# EAGLE design Adapter_board (EAGLE 7.7.0)
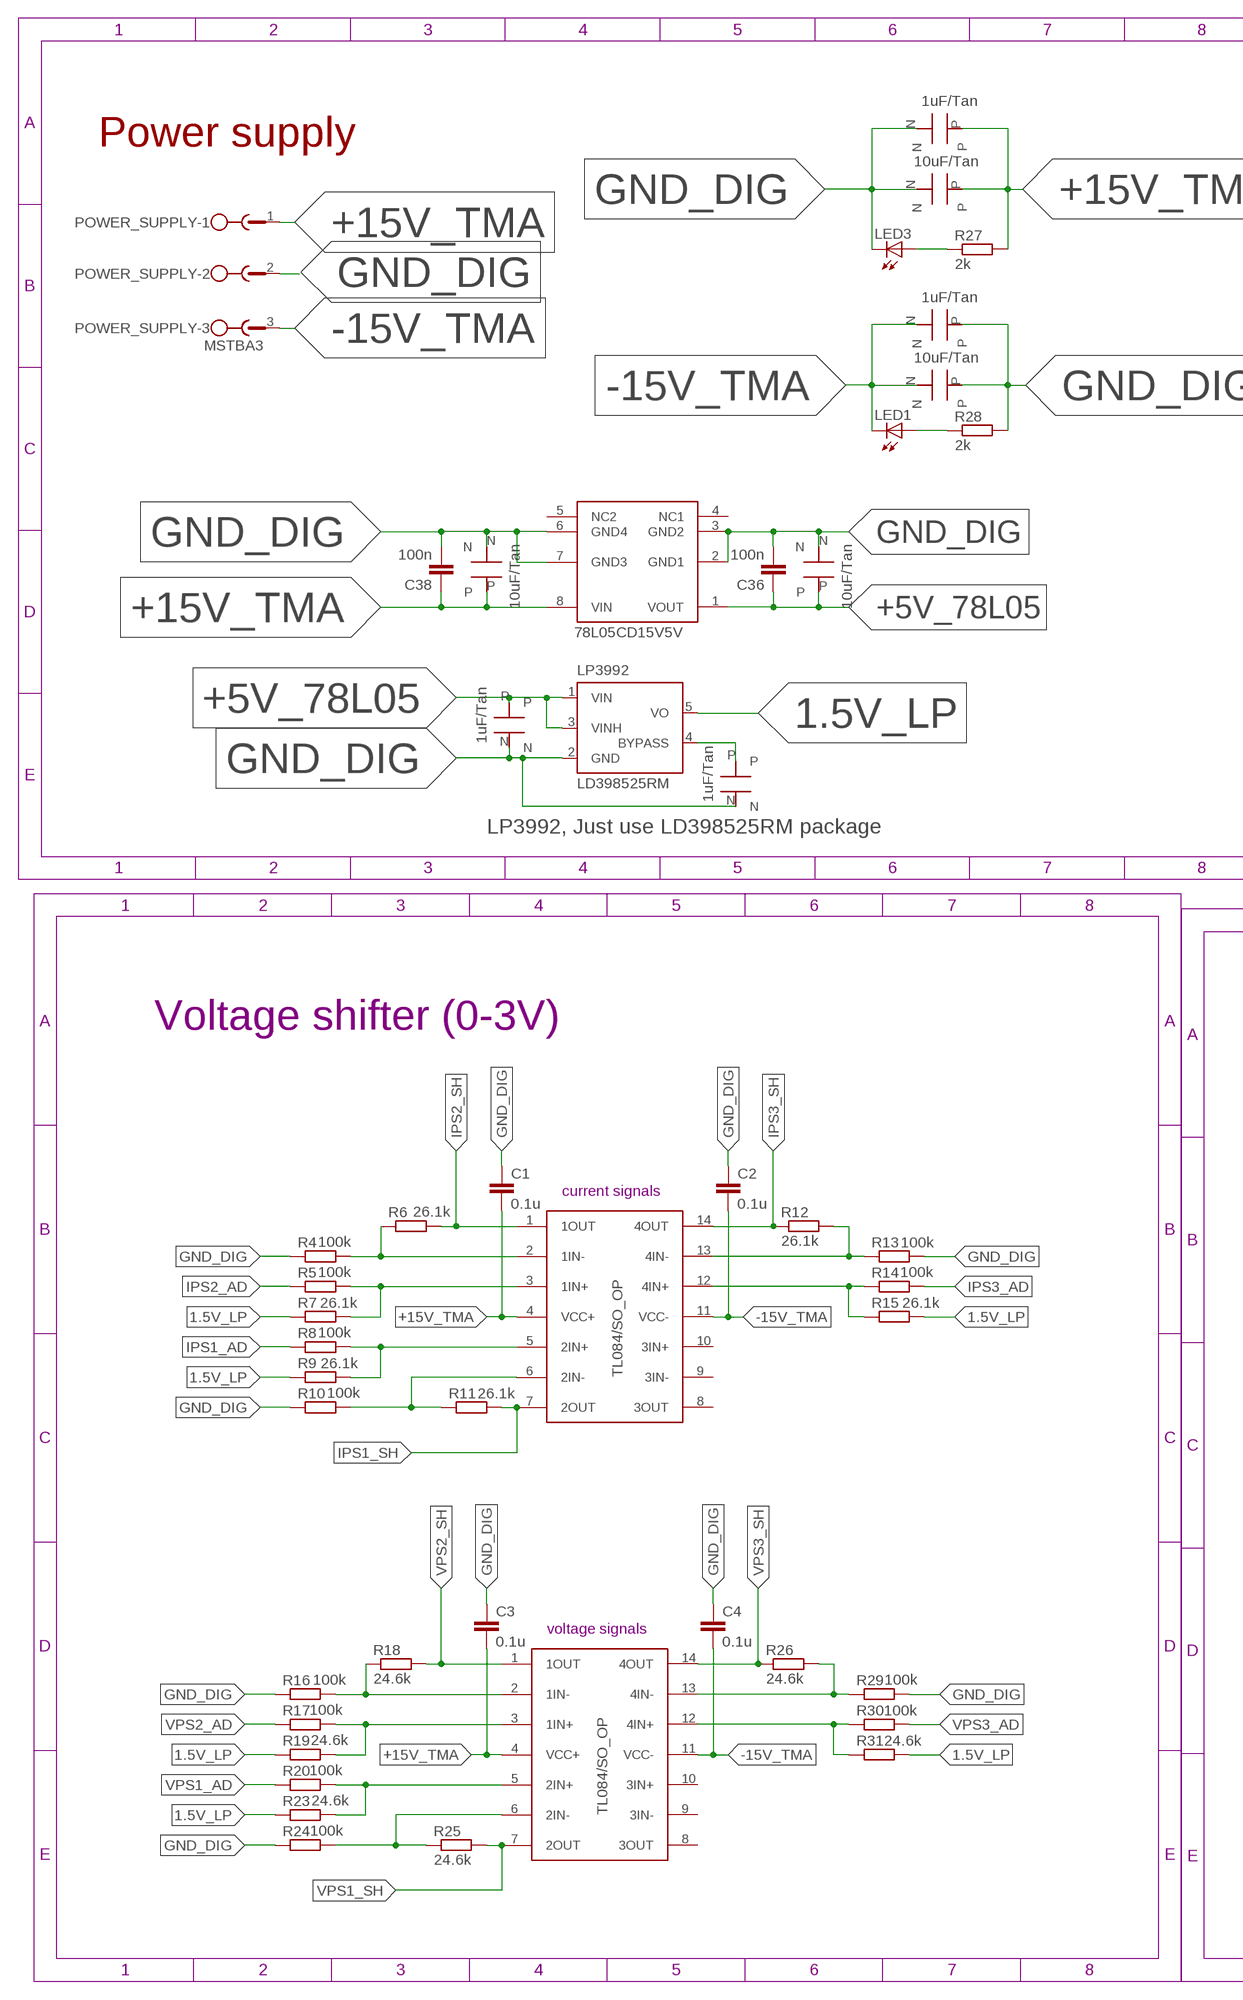
[diagram p0: schematic, sheet 1, part 1 of 2]
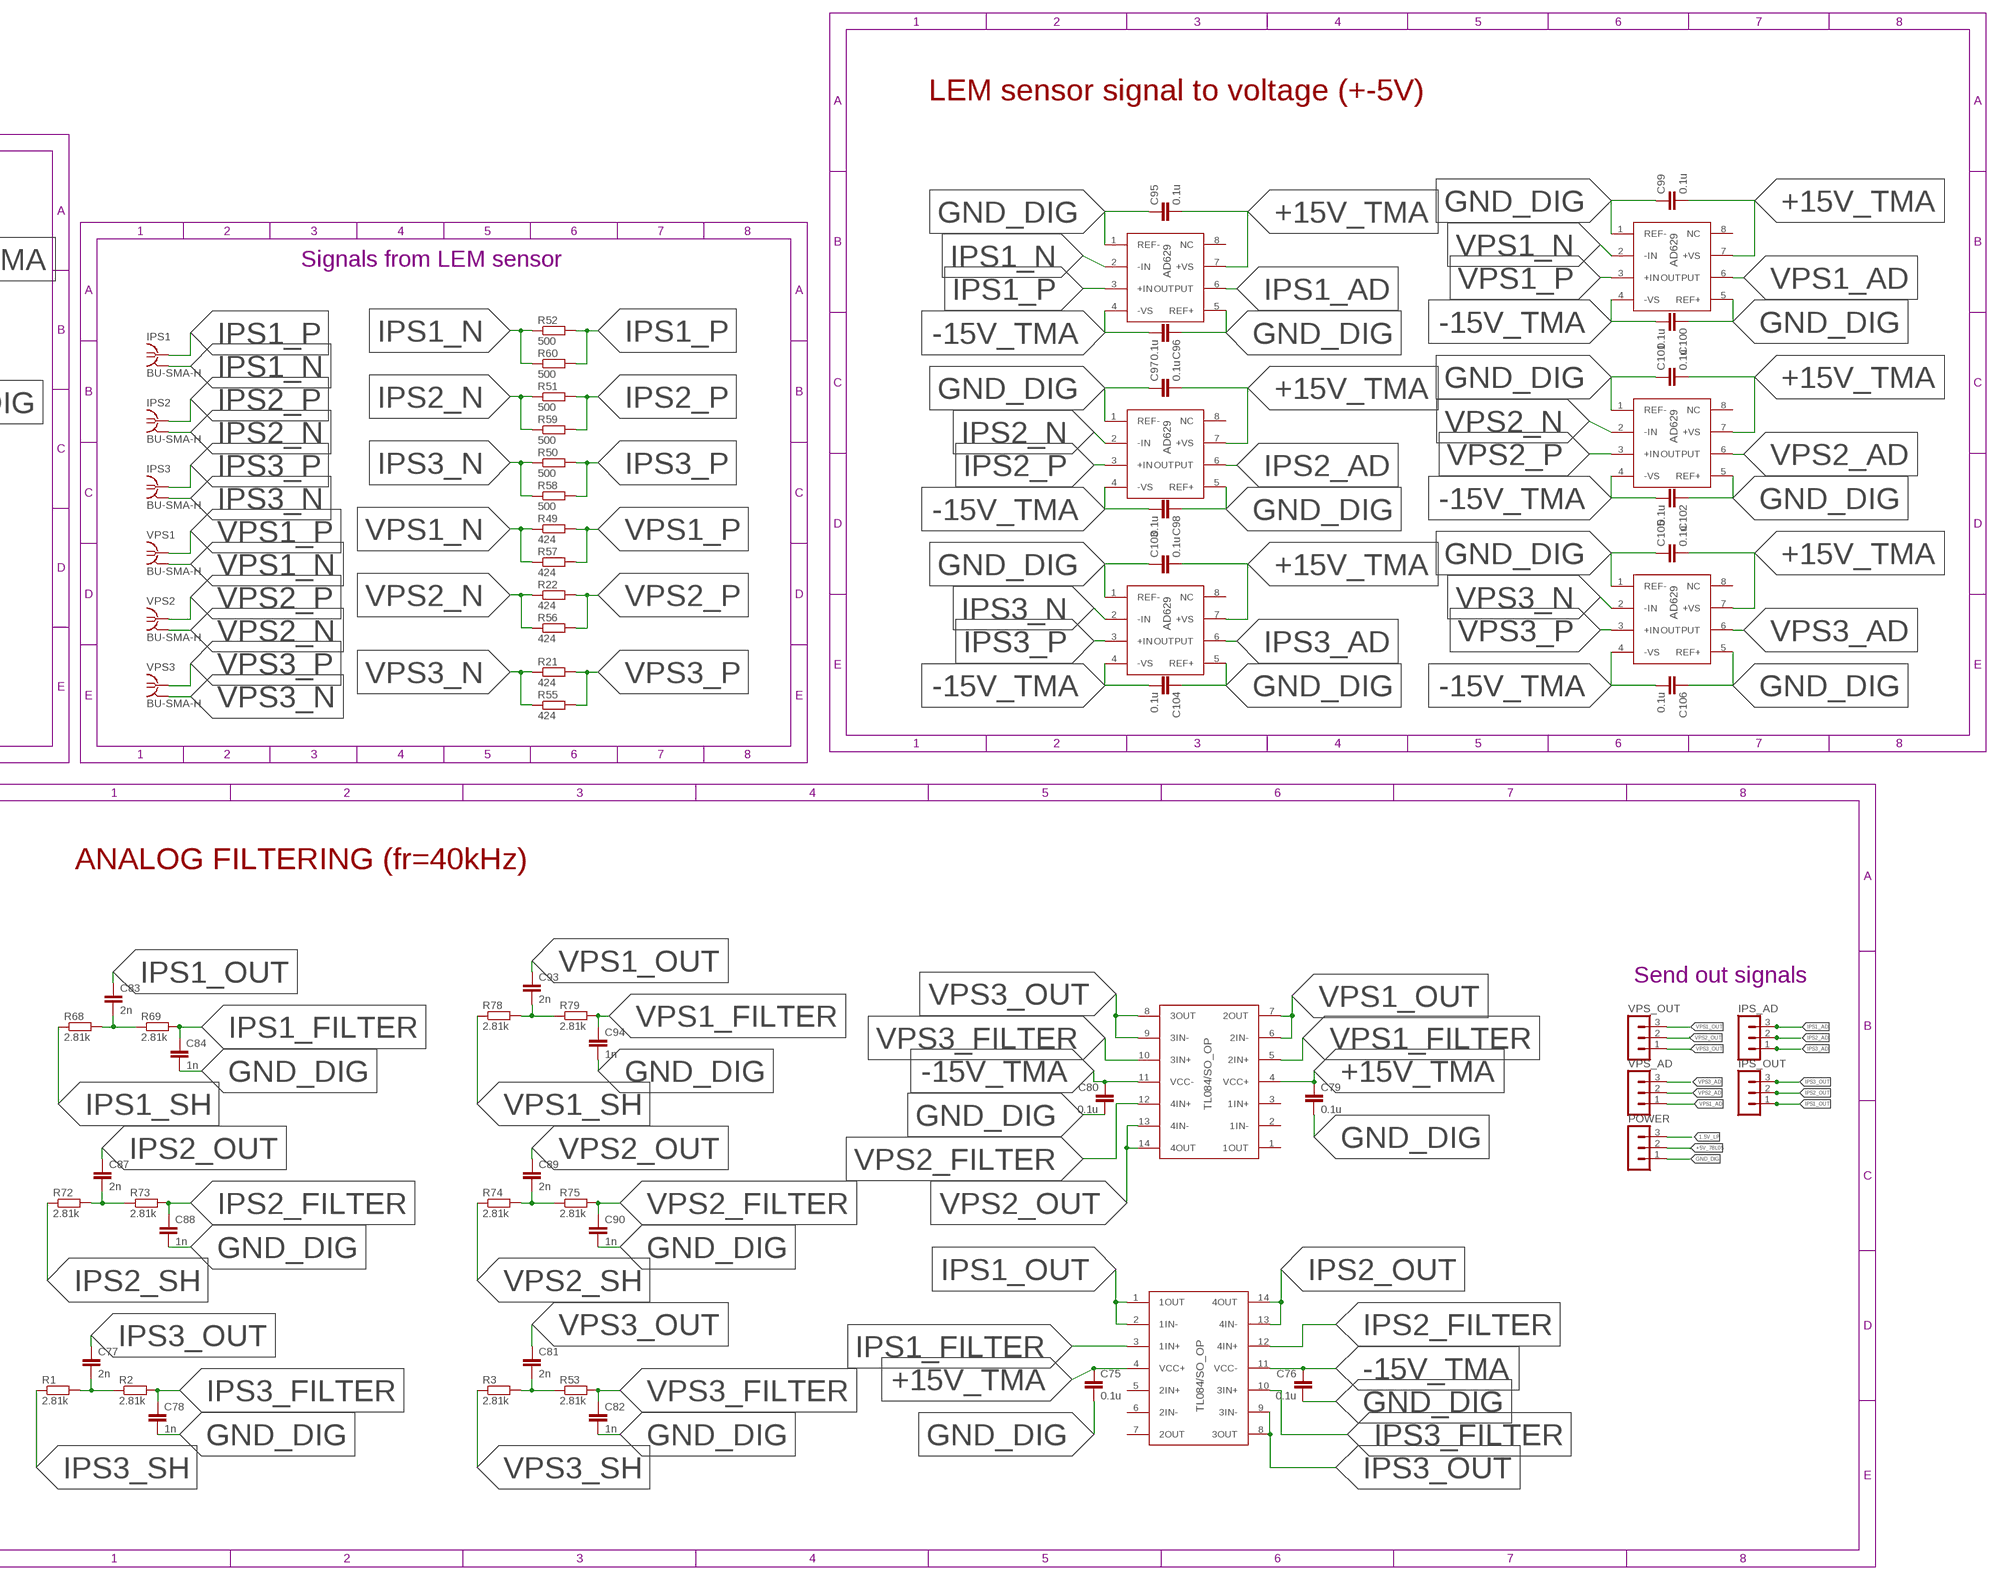
[diagram p1: schematic, sheet 1, part 2 of 2]

## Parts
78L05  78L05CD15V5VONLINE  [78L05CD15V5V_LIB]
C1  0.1u  C-EUC0805  [C0805]
C2  0.1u  C-EUC0805  [C0805]
C3  0.1u  C-EUC0805  [C0805]
C4  0.1u  C-EUC0805  [C0805]
C36  100n  C-EUC0805  [C0805]
C37  TANTALUM_C_10UF_KEM  [TANTALUM_C_10UF_KEM]
C38  100n  C-EUC0805  [C0805]
C75  0.1u  C-EUC0805  [C0805]
C76  0.1u  C-EUC0805  [C0805]
C77  2n  C-EUC0805  [C0805]
C78  1n  C-EUC0805  [C0805]
C79  0.1u  C-EUC0805  [C0805]
C80  0.1u  C-EUC0805  [C0805]
C81  2n  C-EUC0805  [C0805]
C82  1n  C-EUC0805  [C0805]
C83  2n  C-EUC0805  [C0805]
C84  1n  C-EUC0805  [C0805]
C87  2n  C-EUC0805  [C0805]
C88  1n  C-EUC0805  [C0805]
C89  2n  C-EUC0805  [C0805]
C90  1n  C-EUC0805  [C0805]
C93  2n  C-EUC0805  [C0805]
C94  1n  C-EUC0805  [C0805]
C95  0.1u  C-EUC0805  [C0805]
C96  0.1u  C-EUC0805  [C0805]
C97  0.1u  C-EUC0805  [C0805]
C98  0.1u  C-EUC0805  [C0805]
C99  0.1u  C-EUC0805  [C0805]
C100  0.1u  C-EUC0805  [C0805]
C101  0.1u  C-EUC0805  [C0805]
C102  0.1u  C-EUC0805  [C0805]
C103  0.1u  C-EUC0805  [C0805]
C104  0.1u  C-EUC0805  [C0805]
C105  0.1u  C-EUC0805  [C0805]
C106  0.1u  C-EUC0805  [C0805]
IPS1  BU-SMA-H  [BU-SMA-H]
IPS2  BU-SMA-H  [BU-SMA-H]
IPS3  BU-SMA-H  [BU-SMA-H]
IPS_AD  MA03-1  [MA03-1]
IPS_OUT  MA03-1  [MA03-1]
LED1  LEDCHIPLED_0805  [CHIPLED_0805]
LED3  LEDCHIPLED_0805  [CHIPLED_0805]
LP3992  LD398525RM  [SOT23-5L]
POWER  MA03-1  [MA03-1]
POWER_SUPPLY  MSTBA3  [MSTBA3]
R1  2.81k  R-EU_R0805  [R0805]
R2  2.81k  R-EU_R0805  [R0805]
R3  2.81k  R-EU_R0805  [R0805]
R4  100k  R-EU_R0805  [R0805]
R5  100k  R-EU_R0805  [R0805]
R6  26.1k  R-EU_R0805  [R0805]
R7  26.1k  R-EU_R0805  [R0805]
R8  100k  R-EU_R0805  [R0805]
R9  26.1k  R-EU_R0805  [R0805]
R10  100k  R-EU_R0805  [R0805]
R11  26.1k  R-EU_R0805  [R0805]
R12  26.1k  R-EU_R0805  [R0805]
R13  100k  R-EU_R0805  [R0805]
R14  100k  R-EU_R0805  [R0805]
R15  26.1k  R-EU_R0805  [R0805]
R16  100k  R-EU_R0805  [R0805]
R17  100k  R-EU_R0805  [R0805]
R18  24.6k  R-EU_R0805  [R0805]
R19  24.6k  R-EU_R0805  [R0805]
R20  100k  R-EU_R0805  [R0805]
R21  424  R-EU_R1206  [R1206]
R22  424  R-EU_R1206  [R1206]
R23  24.6k  R-EU_R0805  [R0805]
R24  100k  R-EU_R0805  [R0805]
R25  24.6k  R-EU_R0805  [R0805]
R26  24.6k  R-EU_R0805  [R0805]
R27  2k  R-EU_R0805  [R0805]
R28  2k  R-EU_R0805  [R0805]
R29  100k  R-EU_R0805  [R0805]
R30  100k  R-EU_R0805  [R0805]
R31  24.6k  R-EU_R0805  [R0805]
R49  424  R-EU_R1206  [R1206]
R50  500  R-EU_R1206  [R1206]
R51  500  R-EU_R1206  [R1206]
R52  500  R-EU_R1206  [R1206]
R53  2.81k  R-EU_R0805  [R0805]
R55  424  R-EU_R1206  [R1206]
R56  424  R-EU_R1206  [R1206]
R57  424  R-EU_R1206  [R1206]
R58  500  R-EU_R1206  [R1206]
R59  500  R-EU_R1206  [R1206]
R60  500  R-EU_R1206  [R1206]
R68  2.81k  R-EU_R0805  [R0805]
R69  2.81k  R-EU_R0805  [R0805]
R72  2.81k  R-EU_R0805  [R0805]
R73  2.81k  R-EU_R0805  [R0805]
R74  2.81k  R-EU_R0805  [R0805]
R75  2.81k  R-EU_R0805  [R0805]
R78  2.81k  R-EU_R0805  [R0805]
R79  2.81k  R-EU_R0805  [R0805]
U$1  TL084/SO_OPONLINE  [TL084/SO_OP_LIB]
U$2  TL084/SO_OPONLINE  [TL084/SO_OP_LIB]
U$3  TANTALUM_C_1UF_KEMTANTALUM_C_1UF_KEM  [TANTALUM_C_1UF_KEM]
U$4  TL084/SO_OPONLINE  [TL084/SO_OP_LIB]
U$5  TANTALUM_C_1UF_KEMTANTALUM_C_1UF_KEM  [TANTALUM_C_1UF_KEM]
U$6  TL084/SO_OPONLINE  [TL084/SO_OP_LIB]
U$10  TANTALUM_C_1UF_KEMTANTALUM_C_1UF_KEM  [TANTALUM_C_1UF_KEM]
U$11  TANTALUM_C_10UF_KEM  [TANTALUM_C_10UF_KEM]
U$12  TANTALUM_C_1UF_KEMTANTALUM_C_1UF_KEM  [TANTALUM_C_1UF_KEM]
U$14  TANTALUM_C_10UF_KEM  [TANTALUM_C_10UF_KEM]
U$24  AD629_DIFFAONLINE  [AD629_DIFFA_LIB]
U$27  AD629_DIFFAONLINE  [AD629_DIFFA_LIB]
U$28  AD629_DIFFAONLINE  [AD629_DIFFA_LIB]
U$29  AD629_DIFFAONLINE  [AD629_DIFFA_LIB]
U$30  AD629_DIFFAONLINE  [AD629_DIFFA_LIB]
U$31  AD629_DIFFAONLINE  [AD629_DIFFA_LIB]
U$66  TANTALUM_C_10UF_KEM  [TANTALUM_C_10UF_KEM]
VPS1  BU-SMA-H  [BU-SMA-H]
VPS2  BU-SMA-H  [BU-SMA-H]
VPS3  BU-SMA-H  [BU-SMA-H]
VPS_AD  MA03-1  [MA03-1]
VPS_OUT  MA03-1  [MA03-1]

## Nets
1.5V_LP: LP3992.5(VO) POWER.3 R7.1 R9.1 R15.2 R19.1 R23.1 R31.2
+5V_78L05: 78L05.1(VOUT) C36.1 C37.P LP3992.1(VIN) LP3992.3(VINH) POWER.2 U$3.P
+15V_TMA: 78L05.8(VIN) C1.2 C3.2 C38.1 C75.1 C79.1 C95.2 C97.2 C99.2 C101.2 C103.2 C105.2 POWER_SUPPLY.1 R27.2 U$1.4(VCC+) U$2.4(VCC+) U$4.4(VCC+) U$6.4(VCC+) U$10.P U$11.P U$24.7(+VS) U$27.7(+VS) U$28.7(+VS) U$29.7(+VS) U$30.7(+VS) U$31.7(+VS) U$66.P
-15V_TMA: C2.2 C4.2 C76.1 C80.1 C96.2 C98.2 C100.2 C102.2 C104.2 C106.2 LED1.C POWER_SUPPLY.3 U$1.11(VCC-) U$2.11(VCC-) U$4.11(VCC-) U$6.11(VCC-) U$12.N U$14.N U$24.4(-VS) U$27.4(-VS) U$28.4(-VS) U$29.4(-VS) U$30.4(-VS) U$31.4(-VS)
GND_DIG: 78L05.2(GND1) 78L05.3(GND2) 78L05.6(GND4) 78L05.7(GND3) C1.1 C2.1 C3.1 C4.1 C36.2 C37.N C38.2 C75.2 C76.2 C78.2 C79.2 C80.2 C82.2 C84.2 C88.2 C90.2 C94.2 C95.1 C96.1 C97.1 C98.1 C99.1 C100.1 C101.1 C102.1 C103.1 C104.1 C105.1 C106.1 LED3.C LP3992.2(GND) POWER.1 POWER_SUPPLY.2 R4.1 R10.1 R13.2 R16.1 R24.1 R28.2 R29.2 U$3.N U$5.N U$10.N U$11.N U$12.P U$14.P U$24.1(REF-) U$24.5(REF+) U$27.1(REF-) U$27.5(REF+) U$28.1(REF-) U$28.5(REF+) U$29.1(REF-) U$29.5(REF+) U$30.1(REF-) U$30.5(REF+) U$31.1(REF-) U$31.5(REF+) U$66.N
IPS1_AD: IPS_AD.3 R8.1 U$24.6(OUTPUT)
IPS1_FILTER: C84.1 R69.2 U$4.3(1IN+)
IPS1_N: IPS1.2 IPS1.3 IPS1.4 IPS1.5 R52.1 R60.1 U$24.2(-IN)
IPS1_OUT: C83.1 IPS_OUT.1 U$4.1(1OUT) U$4.2(1IN-)
IPS1_P: IPS1.1 R52.2 R60.2 U$24.3(+IN)
IPS1_SH: R11.2 R68.1 U$1.7(2OUT)
IPS2_AD: IPS_AD.2 R5.1 U$27.6(OUTPUT)
IPS2_FILTER: C88.1 R73.2 U$4.12(4IN+)
IPS2_N: IPS2.2 IPS2.3 IPS2.4 IPS2.5 R51.1 R59.1 U$27.2(-IN)
IPS2_OUT: C87.1 IPS_OUT.2 U$4.13(4IN-) U$4.14(4OUT)
IPS2_P: IPS2.1 R51.2 R59.2 U$27.3(+IN)
IPS2_SH: R6.2 R72.1 U$1.1(1OUT)
IPS3_AD: IPS_AD.1 R14.2 U$30.6(OUTPUT)
IPS3_FILTER: C78.1 R2.2 U$4.10(3IN+)
IPS3_N: IPS3.2 IPS3.3 IPS3.4 IPS3.5 R50.1 R58.1 U$30.2(-IN)
IPS3_OUT: C77.1 IPS_OUT.3 U$4.8(3OUT) U$4.9(3IN-)
IPS3_P: IPS3.1 R50.2 R58.2 U$30.3(+IN)
IPS3_SH: R1.1 R12.1 U$1.14(4OUT)
N$2: LP3992.4(BYPASS) U$5.P
N$3: R4.2 R6.1 U$1.2(1IN-)
N$4: R5.2 R7.2 U$1.3(1IN+)
N$5: R16.2 R18.1 U$2.2(1IN-)
N$6: R10.2 R11.1 U$1.6(2IN-)
N$7: R8.2 R9.2 U$1.5(2IN+)
N$8: R17.2 R19.2 U$2.3(1IN+)
N$9: C77.2 R1.2 R2.1
N$10: C81.2 R3.2 R53.1
N$11: C83.2 R68.2 R69.1
N$12: LED3.A R27.1
N$14: LED1.A R28.1
N$15: C87.2 R72.2 R73.1
N$16: R20.2 R23.2 U$2.5(2IN+)
N$17: C89.2 R74.2 R75.1
N$19: C93.2 R78.2 R79.1
N$20: R12.2 R13.1 U$1.13(4IN-)
N$21: R14.1 R15.1 U$1.12(4IN+)
N$22: R24.2 R25.1 U$2.6(2IN-)
N$23: R26.2 R29.1 U$2.13(4IN-)
N$24: R30.1 R31.1 U$2.12(4IN+)
VPS1_AD: R20.1 U$28.6(OUTPUT) VPS_AD.1
VPS1_FILTER: C94.1 R79.2 U$6.5(2IN+)
VPS1_N: R49.1 R57.1 U$28.2(-IN) VPS1.2 VPS1.3 VPS1.4 VPS1.5
VPS1_OUT: C93.1 U$6.6(2IN-) U$6.7(2OUT) VPS_OUT.3
VPS1_P: R49.2 R57.2 U$28.3(+IN) VPS1.1
VPS1_SH: R25.2 R78.1 U$2.7(2OUT)
VPS2_AD: R17.1 U$29.6(OUTPUT) VPS_AD.2
VPS2_FILTER: C90.1 R75.2 U$6.12(4IN+)
VPS2_N: R22.1 R56.1 U$29.2(-IN) VPS2.2 VPS2.3 VPS2.4 VPS2.5
VPS2_OUT: C89.1 U$6.13(4IN-) U$6.14(4OUT) VPS_OUT.2
VPS2_P: R22.2 R56.2 U$29.3(+IN) VPS2.1
VPS2_SH: R18.2 R74.1 U$2.1(1OUT)
VPS3_AD: R30.2 U$31.6(OUTPUT) VPS_AD.3
VPS3_FILTER: C82.1 R53.2 U$6.10(3IN+)
VPS3_N: R21.1 R55.1 U$31.2(-IN) VPS3.2 VPS3.3 VPS3.4 VPS3.5
VPS3_OUT: C81.1 U$6.8(3OUT) U$6.9(3IN-) VPS_OUT.1
VPS3_P: R21.2 R55.2 U$31.3(+IN) VPS3.1
VPS3_SH: R3.1 R26.1 U$2.14(4OUT)
Unconnected: 78L05.4(NC1) 78L05.5(NC2) U$1.8(3OUT) U$1.9(3IN-) U$1.10(3IN+) U$2.8(3OUT) U$2.9(3IN-) U$2.10(3IN+) U$4.5(2IN+) U$4.6(2IN-) U$4.7(2OUT) U$6.1(1OUT) U$6.2(1IN-) U$6.3(1IN+) U$24.8(NC) U$27.8(NC) U$28.8(NC) U$29.8(NC) U$30.8(NC) U$31.8(NC)

## Notes on the sheet
- LEM sensor signal to voltage (+-5V)
- Power supply
- Signals from LEM sensor
- LP3992, Just use LD398525RM package
- Voltage shifter (0-3V) | ANALOG FILTERING (fr=40kHz)
- Send out signals
- current signals
- voltage signals

## Library data of the parts
78L05 = Submodule:78L05CD15V5V: 78L05CD 15 V- 5 V voltage regulator
C1-C4 C36 C38 C75-C84 C87-C90 C93-C106 = rcl:C-EU: CAPACITOR, European symbol
C37 U$11 U$14 U$66 = Submodule:TANTALUM_C_10UF_KEM
IPS1-IPS3 VPS1-VPS3 = con-coax:BU-SMA-H: FEMALE SMA CONNECTOR Radiall; OC_FARNELL: unknown; OC_NEWARK: unknown
IPS_AD IPS_OUT POWER VPS_AD VPS_OUT = con-lstb:MA03-1: PIN HEADER; OC_FARNELL: unknown; OC_NEWARK: unknown
LED1 LED3 = led:LED: LED OSRAM: - CHIPLED LG R971, LG N971, LY N971, LG Q971, LY Q971, LO R971, LY R971 LH N974, LH R974 LS Q976, LO Q976, LY Q976 LO Q996 - Hyper CHIPLED LW Q18S LB Q993, LB Q99A, LB R99A - SideLED LS A670, LO A670, LY A670, LG A670, LP A670 LB A673, LV A673, LT A673, LW A673 LH A674 LY A675 LS A676, LA A676, LO A676, LY A676, LW A676 LS A679, LY A679, LG A679 - Hyper Micro SIDELED® LS Y876, LA Y876, LO Y876, LY Y876 LT Y87S - SmartLED LW L88C, LW L88S LB L89C, LB L89S, LG L890 LS L89K, LO L89K, LY L89K LS L896, LA L896, LO L896, LY L896 - TOPLED LS T670, LO T670, LY T670, LG T670, LP T670 LSG T670, LSP T670, LSY T670, LOP T670, LYG T670 LG T671, LOG T671, LSG T671 LB T673, LV T673, LT T673, LW T673 LH T674 LS T676, LA T676, LO T676, LY T676, LB T676, LH T676, LSB T676, LW T676 LB T67C, LV T67C, LT T67C, LS T67K, LO T67K, LY T67K, LW E67C LS E67B, LA E67B, LO E67B, LY E67B, LB E67C, LV E67C, LT E67C LW T67C LS T679, LY T679, LG T679 LS T770, LO T770, LY T770, LG T770, LP T770 LB T773, LV T773, LT T773, LW T773 LH T774 LS E675, LA E675, LY E675, LS T675 LS T776, LA T776, LO T776, LY T776, LB T776 LHGB T686 LT T68C, LB T68C - Hyper Mini TOPLED® LB M676 - Mini TOPLED Santana® LG M470 LS M47K, LO M47K, LY M47K Source: http://www.osram.convergy.de LUXEON: - LUMILED® LXK2-PW12-R00, LXK2-PW12-S00, LXK2-PW14-U00, LXK2-PW14-V00 LXK2-PM12-R00, LXK2-PM12-S00, LXK2-PM14-U00 LXK2-PE12-Q00, LXK2-PE12-R00, LXK2-PE12-S00, LXK2-PE14-T00, LXK2-PE14-U00 LXK2-PB12-K00, LXK2-PB12-L00, LXK2-PB12-M00, LXK2-PB14-N00, LXK2-PB14-P00, LXK2-PB14-Q00 LXK2-PR12-L00, LXK2-PR12-M00, LXK2-PR14-Q00, LXK2-PR14-R00 LXK2-PD12-Q00, LXK2-PD12-R00, LXK2-PD12-S00 LXK2-PH12-R00, LXK2-PH12-S00 LXK2-PL12-P00, LXK2-PL12-Q00, LXK2-PL12-R00 Source: www.luxeon.com KINGBRIGHT: KA-3528ASYC Source: www.kingbright.com
LP3992 = st-microelectronics:LD3985: Ultra low drop and low noise BiCMOS voltage regulators Source: www.st.com LD3985.pdf
POWER_SUPPLY = con-phoenix-508:MSTBA3: PHOENIX; MF: FARNELL; MPN: 1757255; OC_FARNELL: 3705183; OC_NEWARK: 71C4162
R1-R31 R49-R53 R55-R60 R68 R69 R72-R75 R78 R79 = rcl:R-EU_: RESISTOR, European symbol
U$1 U$2 U$4 U$6 = Submodule:TL084/SO_OP
U$3 U$5 U$10 U$12 = Submodule:TANTALUM_C_1UF_KEM
U$24 U$27-U$31 = Submodule:AD629_DIFFA

## Board
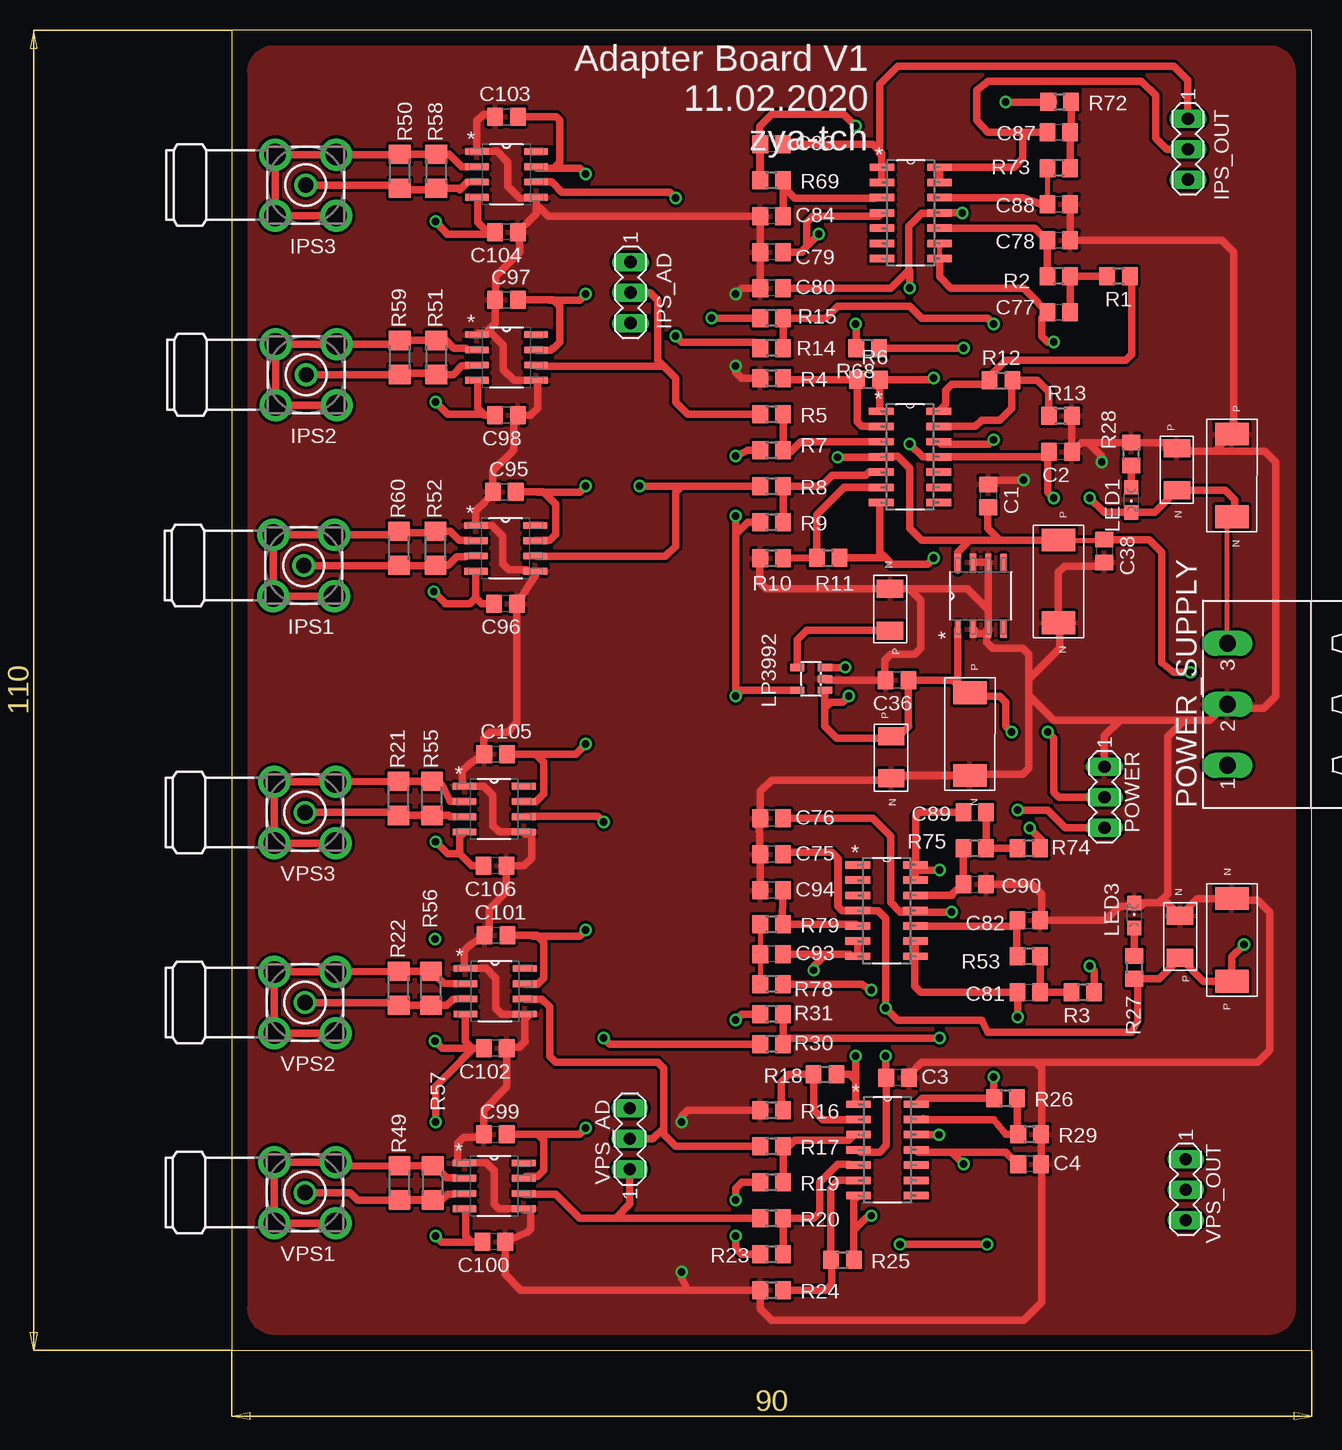
[diagram p2: board, top side]
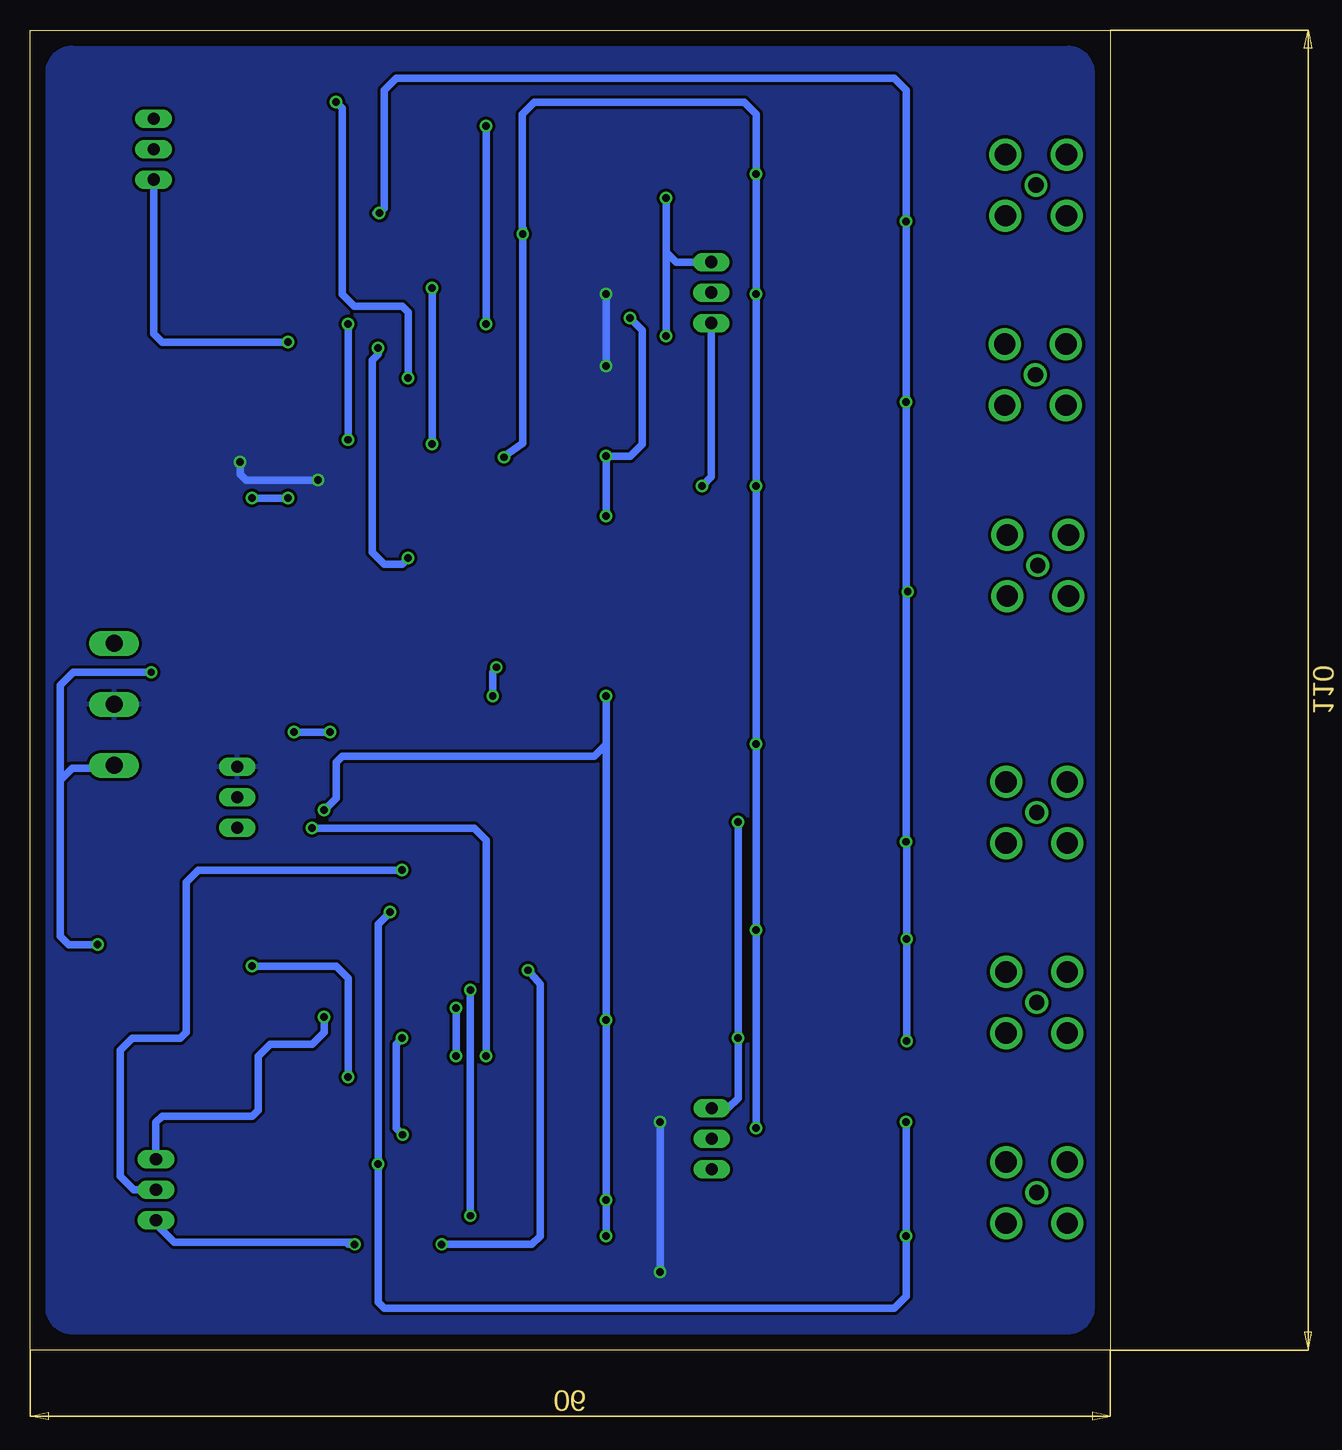
[diagram p3: board, bottom side, seen from below]

Size 90 x 110 mm. Coordinates in mm from the lower left corner, seen from the top.
Outline: 0,0 90,0 90,110 0,110 0,0
Copper layers (1*16): Top 0.035mm / dielectric 1.5mm / Bottom 0.035mm
Design rules "default *": minimum track width 10mil, minimum drill 0.3mm, track to track 8mil, track to pad 8mil, pad to pad 8mil, via to via 8mil, smd to smd 8mil, copper to edge 40mil, drill to drill 8mil, minimum pad ring 10mil, minimum via ring 8mil, stop-mask expansion 4mil, vias tented up to drill 0mil, thermal gap 10mil

### Footprints (pad centres in the part's own frame; a part is rotated, then mirrored left to right if it is on the bottom)
78L05CD15V5V_LIB = smd 1.422 x 0.533: 1 -2.927,1.787; 2 -2.927,0.517; 3 -2.927,-0.753; 4 -2.927,-2.023; 5 2.661,-2.023; 6 2.661,-0.753; 7 2.661,0.517; 8 2.661,1.787
C0805 = smd 1.3 x 1.5: 1 -0.95,0; 2 0.95,0
TANTALUM_C_10UF_KEM = smd 1.9 x 2.8: N 3.45,0; P -3.45,0
BU-SMA-H = drill 1.27: 1 0,0 | drill 1.778: 2 -2.55,2.55; 3 2.55,2.55; 4 2.55,-2.55; 5 -2.55,-2.55
MA03-1 = drill 1.016 long: 1 -2.54,0; 2 0,0; 3 2.54,0
CHIPLED_0805 = smd 1.2 x 1.2: A 0,-1.05; C 0,1.05
SOT23-5L = smd 0.6 x 1.2: 1 -0.95,-1.15; 2 0,-1.15; 3 0.95,-1.15; 4 0.95,1.15; 5 -0.95,1.15
MSTBA3 = drill 1.397 long: 1 -5.08,5.08; 2 0,5.08; 3 5.08,5.08
R0805 = smd 1.3 x 1.5: 1 -0.95,0; 2 0.95,0
R1206 = smd 1.6 x 1.803: 1 -1.422,0; 2 1.422,0
TL084/SO_OP_LIB = smd 2.057 x 0.61: 1 -2.261,3.81; 2 -2.261,2.54; 3 -2.261,1.27; 4 -2.261,0; 5 -2.261,-1.27; 6 -2.261,-2.54; 7 -2.261,-3.81; 8 2.54,-3.81; 9 2.54,-2.54; 10 2.54,-1.27; 11 2.54,0; 12 2.54,1.27; 13 2.54,2.54; 14 2.54,3.81
TANTALUM_C_1UF_KEM = smd 1.5 x 2.2: N 1.75,0; P -1.75,0
AD629_DIFFA_LIB = smd 1.981 x 0.559: 1 -2.464,1.905; 2 -2.464,0.635; 3 -2.464,-0.635; 4 -2.464,-1.905; 5 2.464,-1.905; 6 2.464,-0.635; 7 2.464,0.635; 8 2.464,1.905

### Placement (x,y rotation side)
78L05  62.3,62.98 90 top
C1  63.05,71.18 270 top
C2  69.08,74.85 180 top
C3  55.5,22.7 180 top
C4  66.5,15.5 180 top
C36  55.46,55.82 180 top
C37  61.52,51.33 270 top
C38  72.72,66.58 270 top
C75  45,41.3 180 top
C76  45,44.3 180 top
C77  68.93,86.5 0 top
C78  68.93,92.5 0 top
C79  45,91.5 180 top
C80  45,88.5 180 top
C81  66.43,29.8 0 top
C82  66.43,35.8 0 top
C83  45,100.5 180 top
C84  45,94.5 180 top
C87  68.93,101.5 0 top
C88  68.93,95.5 0 top
C89  61.93,44.8 0 top
C90  61.93,38.8 0 top
C93  45,33 180 top
C94  45,38.3 180 top
C95  22.73,71.52 0 top
C96  22.83,62.2 180 top
C97  22.91,87.52 0 top
C98  22.91,77.9 180 top
C99  21.98,17.98 0 top
C100  21.85,9.01 180 top
C101  22.03,34.58 0 top
C102  21.98,25.13 180 top
C103  22.91,102.78 0 top
C104  22.91,93.16 180 top
C105  22.01,49.66 0 top
C106  21.96,40.34 180 top
IPS1  6.01,65.37 180 top
IPS2  6.22,81.27 180 top
IPS3  6.17,97.07 180 top
IPS_AD  33.23,88.12 270 top
IPS_OUT  79.7,100.08 270 top
LED1  74.97,70.85 180 top
LED3  75.22,36.2 0 top
LP3992  48.28,55.92 90 top
POWER  72.74,46.07 270 top
POWER_SUPPLY  88.07,53.81 90 top
R1  73.91,89.49 180 top
R2  68.93,89.5 180 top
R3  70.93,29.8 180 top
R4  45,81 0 top
R5  45,78 0 top
R6  53.08,80.84 0 top
R7  45,75 0 top
R8  45,72 0 top
R9  45,69 0 top
R10  45,66 0 top
R11  49.72,66 0 top
R12  64.11,80.8 0 top
R13  69.08,77.85 0 top
R14  45,83.5 180 top
R15  45,86 180 top
R16  45,20 0 top
R17  45,17 0 top
R18  49.44,22.97 0 top
R19  45,14 0 top
R20  45,11 0 top
R21  13.9,45.97 270 top
R22  13.93,30.15 270 top
R23  45,8 0 top
R24  45,5 0 top
R25  50.9,7.51 0 top
R26  64.5,21 0 top
R27  75.22,31.89 270 top
R28  74.97,74.67 90 top
R29  66.5,18 0 top
R30  45,25.5 180 top
R31  45,28 180 top
R49  14.01,13.92 270 top
R50  14.02,98.23 270 top
R51  17.06,82.71 270 top
R52  16.98,66.81 270 top
R53  66.43,32.8 180 top
R55  16.69,45.97 270 top
R56  16.61,30.15 270 top
R57  16.77,13.92 270 top
R58  17.06,98.23 270 top
R59  14.02,82.71 270 top
R60  13.94,66.81 270 top
R68  53,83.5 180 top
R69  45,97.5 0 top
R72  69,104.03 0 top
R73  68.93,98.5 180 top
R74  66.43,41.8 180 top
R75  61.93,41.8 180 top
R78  45,30.5 180 top
R79  45,35.5 0 top
U$1  56.4,74.42 0 top
U$2  54.51,16.68 0 top
U$3  54.97,49.4 270 top
U$4  56.45,94.76 0 top
U$5  54.87,61.7 90 top
U$6  54.45,36.62 0 top
U$10  79.03,34.42 90 top
U$11  83.35,34.17 90 top
U$12  78.78,73.39 270 top
U$14  83.35,72.88 270 top
U$24  22.83,66.81 0 top
U$27  22.91,82.71 0 top
U$28  21.88,13.67 0 top
U$29  21.95,29.89 0 top
U$30  22.91,97.97 0 top
U$31  21.88,45.08 0 top
U$66  68.91,64.04 270 top
VPS1  6.12,13.12 180 top
VPS2  6.11,28.95 180 top
VPS3  6.12,44.8 180 top
VPS_AD  33.19,17.59 90 top
VPS_OUT  79.51,13.36 270 top

### Tracks (layer width: path | path; a pad name or v marks a point on that pad's centre or on a via)
1.5V_LP  (via drill 0.6)
  Top 0.61: R19.1 42.5,14 42,13.5 v42,12.5 | v42,9.5 42,8.5 42.5,8 R23.1 | R31.2 42.5,28 v42,27.5 | 42,69 v42,69.5 42,68 | v42,74.5 43,75 R7.1 | LP3992.5 47.11,55 42.5,55 | 42.5,55 42,55 42,68 | v42,54.5 42.5,55 | R9.1 43,69 42,68 | POWER.3 69.47,43.53 68,45 v65.5,45 | R15.2 v40,86
  Bottom 0.61: v42,9.5 v42,12.5 v42,27.5 42,50.5 | v42,69.5 v42,74.5 40,74.5 39,75.5 39,85 v40,86 | 42,50.5 v42,54.5 | v65.5,45 64.5,46 64.5,49 64,49.5 43,49.5 42,50.5
+5V_78L05  (via drill 0.6)
  Top 0.254: 62,54.5 61.52,54.5 C37.P 60.93,54.78 60.93,55
  Top 0.61: 60.43,55.5 60.11,55.82 C36.1 56.41,52.02 56.43,52 55.93,51.5 55.32,51.5 U$3.P 54.82,51 50.43,51 49.43,52 49.44,52.01 49.44,53.5 | 60.43,55.5 60.93,55 | 78L05.1 60.52,55.59 60.43,55.5 | LP3992.1 49.44,53.5 | LP3992.3 51.1,56.88 v51.13,56.9 | v51.43,54.5 50.93,54 49.94,54 49.44,53.5 | POWER.2 68.93,46.07 68.5,46.5 68.5,51 v68,51.5 | v65,51.5 64.5,52 64.5,54 64,54.5 62,54.5
  Bottom 0.61: v51.13,56.9 51.13,56.8 51.43,56.5 v51.43,54.5 | v68,51.5 v65,51.5
+15V_TMA  (via drill 0.6)
  Top 0.406: U$66.P 72.72,67.49 C38.1
  Top 0.61: 80.03,56.49 v79.91,56.49 78.5,56.49 77.5,57.29 77.5,66.5 76.47,67.53 74,67.53 | v84.37,33.79 83.35,32.77 U$11.P 80.99,30.72 U$10.P 77.3,30.93 R27.2 75.22,30.77 75.5,30.5 75.5,27.5 75,26.5 63,26.5 62.5,27.5 55.5,27.5 v54.5,28.5 54.5,35.95 | 24.34,14.34 U$28.7 24.54,14.5 25.5,14.5 26,15 26,17.5 25.52,17.98 | C97.2 26.5,87.52 | 26.5,87.52 26.81,87.52 27.33,87 27.33,84 26.83,83.5 26.78,83.5 26.58,83.3 25.41,83.3 U$27.7 | C103.2 27.05,102.78 27.33,102.5 27.33,99 26.83,98.5 | 47.93,92 47.43,91.5 C79.1 47.5,91.5 | 47.93,92 47.93,94 48.43,94.5 53.93,94.5 U$4.4 | v48.93,93 47.93,92 | 50.5,41 50.5,37 50.88,36.62 U$6.4 53.88,36.62 53.9,36.6 | 50.5,41 50,41.5 46.15,41.5 | 46.15,41.5 C75.1 45.95,41.35 46.1,41.5 46.15,41.5 | 53.9,36.6 54.5,36 54.5,35.95 | 54.5,23.05 C3.2 | C3.2 54.55,17.05 54,16.5 52.43,16.5 U$2.4 | C95.2 25.5,71.52 | 25.5,71.52 25.98,71.52 27,70.5 27,68 26.5,67.5 25.35,67.5 U$24.7 | 26.83,98.5 25.48,98.5 U$30.7 | 26.83,98.5 26.85,98.5 | 26.85,98.5 27.35,99 27.35,102.35 | 26.85,98.5 29,98.5 v29.5,98 | v29.5,88 29,87.5 26.52,87.5 26.5,87.52 | v29.5,72 29,71.5 25.52,71.5 25.5,71.52 | U$31.7 24.36,45.7 25.35,45.7 26,46.35 26,49 25.34,49.66 C105.2 28.66,49.66 v29.5,50.5 | C101.2 25,34.58 | 25,34.58 25.42,34.58 26,34 26,31 25.5,30.5 24.45,30.5 U$29.7 | v29.5,35 29,34.5 25.08,34.5 25,34.58 | C99.2 25.52,17.98 | v29.5,18.5 29,18 25.54,18 25.52,17.98 | 50.5,41 50.55,40.95 50.55,36.95 50.9,36.6 53.9,36.6 | 53.9,36.6 53.9,36.55 54.5,35.95 | v50.5,74.4 54.11,74.4 U$1.4 54.21,74.5 55.5,74.5 56.5,73.5 56.5,68.5 57.51,67.49 61.5,67.49 | v54.5,24.5 54.5,22.75 C3.2 | C38.1 74,67.53 | 74,67.53 74.57,67.53
  Top 0.61: U$66.P 64,67.49 | 64,67.49 61.5,67.49 | 61.5,67.49 61.5,67.5 60.5,66.5 60.5,65 60.52,65.02 78L05.8 | C1.2 63,70.18 63,68.5 64,67.5 64,67.49
  Bottom 0.254: 49,93 v48.93,93
  Bottom 0.61: 48.9,93.43 v48.93,93 48.93,75.57 50.5,74.5 v50.5,74.4 | v29.5,18.5 v29.5,35 v29.5,50.5 v29.5,72 v29.5,88 v29.5,98 29.5,103 30.5,104 48,104 49,103 49,93 | v54.5,28.5 v54.5,24.5 | v84.37,33.79 86.79,33.79 87.5,34.5 87.5,47.5 | 87.5,47.5 86.5,48.5 83.71,48.5 83.51,48.69 83.02,48.69 POWER_SUPPLY.1 | 87.5,47.5 87.5,55.4 86.41,56.49 v79.91,56.49
-15V_TMA  (via drill 0.6)
  Top 0.406: POWER_SUPPLY.3 82.99,69.06 U$14.N
  Top 0.61: 83.61,69.18 U$14.N 83.61,69.43 83.61,70.34 83.61,70.85 82.82,71.64 U$12.N 76.94,69.8 LED1.C 72.7,69.8 v71.5,71 | 20.45,25.14 C102.2 20.14,25.14 18,23 17,22 v17,19 | 20.45,25.14 20.07,25.14 19.45,25.75 19.45,27.95 U$29.4 | C106.2 20.01,40.34 19,41.35 | 19,41.35 19,42.76 U$31.4 | U$28.4 19.5,11.68 19.5,9.5 20,9 | 20,9 20.01,9.01 C100.2 | 55.83,36.5 55.73,36.5 54.93,37.3 54.93,42.8 53.93,43.8 53.43,44.3 C76.1 | 55.83,36.5 55.93,36.6 56.33,36.6 56.35,36.62 U$6.11 | 20,9 17.5,9 v17,9.5 | v16.95,25.75 17.57,25.14 20.45,25.14 | 20.35,62.7 20.85,62.2 C96.2 | U$24.4 20.35,64.89 20.35,62.7 | 20.35,62.7 19.85,62.2 | U$27.4 20.5,80.75 20.5,78.5 21,78 | 21,78 21.1,77.9 C98.2 | U$30.4 20.5,96.01 20.5,94 21.34,93.16 C104.2 | C104.2 21.79,93 | 17,94 18,93 18.05,93 | 18.05,93 21.5,93 21.66,93.16 C104.2 | v17,79 18,78 21,78 | v16.85,63.2 17.85,62.2 19.85,62.2 | v17,42.35 18,41.35 19,41.35 | C80.1 54.93,88.5 56.43,90 | 56.43,90 56.43,93.65 57.53,94.75 U$4.11 v60.87,94.76 v60.88,94.75 | 67.7,74.42 C2.2 | 19.85,62.2 17.8,62.2 | 67.7,74.42 U$1.11 57.58,74.42 v56.5,75.5 | v68.5,71 68,71.5 68,74.13 67.7,74.42 | v56.5,88.5 56.5,89.93 56.43,90 | 18.05,93 17.95,93 v17,94.05 | C4.2 65.5,15.5 64.5,16.5 60,16.5 | 57.75,16.5 57.23,16.5 U$2.11 57.57,16.68 57.75,16.5 | 57.75,16.5 60,16.5 | 60,16.5 v61,15.5 | 55.83,36.5 v60,36.5
  Bottom 0.254: 17,63 16.85,63 v16.85,63.2
  Bottom 0.61: v16.95,25.75 v16.95,34.25 16.95,42.3 v17,42.35 17,63 | v17,19 17,10.5 v17,9.5 17,4.5 18,3.5 60.5,3.5 61,4 v61,15.5 61,35.5 v60,36.5 | v17,94.05 17,87.5 v17,79 17,63.35 v16.85,63.2 | v17,94.05 17,94 | 61.18,94.75 v60.88,94.75 60.5,95.13 60.5,105 59.5,106 18,106 17,105 v17,94.05 | v71.5,71 v68.5,71 | v56.5,75.5 v56.5,88.5
GND_DIG  (via drill 0.6)
  Top 0.61: LED3.C 76,37.25 | 76,37.25 77,37.25 | 77,37.25 77.96,37.25 U$10.N 80.48,37.62 U$11.N 83.47,37.5 85.5,37.5 86.5,36.5 86.5,25 85.5,24 67,24 | 78L05.3 63.06,59.67 62.16,59.67 78L05.2 | 82.56,53.43 81.52,52.49 74.01,52.49 74,52.5 | 82.56,53.43 POWER_SUPPLY.2 | 81.94,74.91 U$14.P 83.5,76.48 83.5,91.5 82.5,92.5 C78.2 C88.2 | 81.94,74.91 79.54,74.91 | C38.2 72.4,65.31 69.42,65.31 68.91,64.81 68.91,61.1 | 68.91,61.1 U$66.N | 63.06,61.7 78L05.6 78L05.7 | 63.06,61.7 78L05.3 | 56.48,63.45 U$5.N 44.55,63.45 44,64 44,65.95 R10.1 | 56.48,63.45 61.31,63.45 63.06,61.7 | 21.13,84.74 21.96,85.57 C97.1 22,87.56 22,89.5 24,91.5 24,93.02 C104.1 25.37,94.68 25.37,95.5 | 21.13,84.74 21.64,84.74 22.65,83.72 22.65,81.69 23.54,80.8 U$27.5 25.5,80.67 25.5,78.5 24.9,77.9 C98.1 23.5,77.54 23.5,75 21.78,73.28 C95.1 21.05,70.62 20.36,69.93 U$24.1 21.69,68.71 22.57,67.83 22.57,65.54 23.08,65.03 24.61,65.03 24.73,64.9 U$24.5 25.29,64.51 C96.1 23.78,52.28 23,51.5 21.5,51.5 21,51 21,49.72 C105.1 19.85,48.86 19.24,48.25 19.24,47.16 U$31.1 21.02,46.98 21.78,46.22 21.78,43.68 22.29,43.17 U$31.5 24.52,43 25,43 25,41 24.34,40.34 C106.1 22.91,38.2 21.45,36.75 21.45,34.95 C101.1 19.8,33.68 19.39,33.27 19.39,31.9 U$29.1 21.2,31.8 22,31 22,28.5 22.5,28 24.41,28 U$29.5 | U$29.5 24.42,25.78 24.45,25.75 23.95,25.25 23.05,25.25 C102.1 22.93,21.93 21,20 21,18.01 C99.1 20.78,17.73 19.34,17.73 18.83,17.23 18.83,15.7 18.96,15.57 U$28.1 19.44,15.6 21.22,15.6 21.88,14.94 21.88,12.15 22.26,11.77 U$28.5 24.47,11.64 24.93,11.64 24.93,10.11 24.62,9.81 C100.1 22.8,6.3 24.11,5 38,5 | 43.93,43.8 43.98,43.75 C75.2 C94.2
  Top 0.61: 24.66,27.75 U$29.5 | R13.2 C2.1 70.8,75.62 71.5,75.62 | LP3992.2 49.54,55.82 C36.2 54.43,55.9 54.43,57.5 54.93,58 56.93,58 57.43,58.5 57.43,62.5 56.48,63.45 | 55.2,47.88 U$3.N 54.82,47.5 45,47.5 44.05,46.55 C76.2 | 55.2,47.88 C37.N | 55.2,47.88 55.23,47.85 62.48,47.85 62.63,48 65.93,48 66.43,48.5 66.43,54 | 66.43,54 66.72,54.28 | 66.43,54 66.43,56 | 66.43,56 66.43,58 65.93,58.5 63.43,58.5 62.93,59 62.93,59.92 78L05.3 | 71.43,52.5 71.93,52.5 71.94,52.49 71.94,52.5 74,52.5 | 68.91,61.1 68.93,61.08 69,61.01 69,58.5 66.5,56 66.43,56 | C103.1 21.74,103 21,103 20.44,102.44 U$30.1 22.12,99.88 23,99 23,97 24,96 25.3,96 U$30.5 25.37,95.5 | 38,5 R24.1 44.05,3.45 45,2.5 66,2.5 67.5,4 67.5,15.45 C4.1 R29.2 67.5,18.05 67.5,23.5 67,24 | C3.1 56.5,23 57.5,24 67,24 | R16.1 38,20 37.5,19.5 v37.5,19 | v37.5,6.5 37.5,6 38,5 | 25.37,95.5 26.37,94.5 C84.2 C79.2 C80.2 42.5,88.5 v42,88 | U$12.P 78.3,75.62 R28.2 71.5,75.62 | 76,37.25 75.75,37 74,37 72.8,35.8 C82.2 67.5,35.92 67.5,38 66.7,38.8 C90.2 | v42,82 42,81.5 42.5,81 R4.1 | POWER.1 72.74,51.19 74,52.46 74,52.5 | 81.94,74.91 86.09,74.91 87,74 87,54.5 86,53.5 82.49,53.5 | 82,53.5 82.49,53.5 | 82.49,53.5 82.56,53.43 | C1.1 63.42,72.5 v66,72.5 | v72.5,74 72.5,74.5 71.5,75.5 71.5,75.62 | 66.72,54.28 66.5,54.5 | 71.43,52.5 79.4,52.5 78,51.1 78,38 77.25,37.25 77,37.25 | 66.72,54.28 68.5,52.5 71.43,52.5 | 21.13,84.74 20.57,84.74 U$27.1
  Top 1.016: 43.93,43.8 43.93,44.18 C76.2 | 79.54,74.91 79.01,74.91 U$12.P
  Bottom 0.61: v37.5,19 v37.5,6.5 | v42,88 v42,82 | v66,72.5 72,72.5 72.5,73 v72.5,74
  pour Top (isolate 0.254): 88.5,3.5 88.5,106.5 arc90 86.5,108.5 3.5,108.5 arc90 1.5,106.5 1.5,3.5 arc90 3.5,1.5 86.5,1.5 arc90
  pour Bottom (isolate 0.254): 88.5,3.5 88.5,106.5 arc90 86.5,108.5 3.5,108.5 arc90 1.5,106.5 1.5,3.5 arc90 3.5,1.5 86.5,1.5 arc90
IPS1_AD  (via drill 0.6)
  Top 0.61: U$24.6 25.32,66.2 25.37,66.15 36.15,66.15 37,67 37,71.5 37.5,72 | 37.5,72 R8.1 | v34,72 37.5,72
  Bottom 0.61: IPS_AD.3 33.23,72.77 v34,72
IPS1_FILTER
  Top 0.254: U$4.3 53.69,96.03 53.69,96.04
  Top 0.61: 53.69,96.04 53.64,95.99 53.63,96 46.93,96 45.88,97.05 R69.2 C84.1
IPS1_N
  Top 0.254: 19.95,67.5 20.36,67.5 U$24.2
  Top 0.61: IPS1.2 IPS1.3 IPS1.4 IPS1.5 13.94,67.92 R60.1 13.8,68.09 16.48,68.09 R52.1 18.22,68.23 18.95,67.5 19.95,67.5
IPS1_OUT
  Top 0.61: U$4.2 U$4.1 54.19,99.5 | 54.19,99.5 54.19,99.74 53.43,100.5 C83.1 | IPS_OUT.1 79.7,105.8 78.5,107 55.5,107 54,105.5 54,99.69 54.19,99.5
IPS1_P
  Top 0.254: R60.2 R52.2 | 19.45,66.1 20.29,66.1 U$24.3
  Top 0.61: IPS1.1 16.47,65.37 R52.2 18.04,65.39 18.75,66.1 19.45,66.1
IPS1_SH  (via drill 0.6)
  Top 0.61: U$1.7 54,70.48 54,66.5 54.5,66 | R68.1 v61,83.5 | v58.5,66 58,65.5 55,65.5 54.5,66 | R11.2 54.5,66
  Bottom 0.61: v61,83.5 61,83 61.5,82.5 61.5,66.5 60.5,65.5 59,65.5 v58.5,66
IPS2_AD
  Top 0.61: U$27.6 25.44,82 36,82 | 36,82 37,81 37,79 38,78 R5.1 | IPS_AD.2 34.88,88.12 35.5,87.5 35.5,82.5 36,82
IPS2_FILTER
  Top 0.254: 67.43,95.5 C88.1
  Top 0.406: R73.2 C88.1
  Top 0.61: 67.43,95.5 65.96,96.03 U$4.12
IPS2_N
  Top 0.254: 19.5,83.5 20.29,83.5 U$27.2
  Top 0.61: IPS2.2 IPS2.3 IPS2.4 IPS2.5 13.71,83.82 R59.1 R51.1 17.87,84.13 18.5,83.5 19.5,83.5
IPS2_OUT
  Top 0.61: U$4.13 U$4.14 65.2,98.57 65.93,99.3 65.93,101 66.43,101.5 67,101.5 | 67,101.5 C87.1 | IPS_OUT.2 77.92,100.08 77,101 77,104.55 75.8,105.75 63.05,105.75 62.1,105 62.1,102.5 63,101.5 67,101.5
IPS2_P
  Top 0.254: 19.76,82.05 20.42,82.05 U$27.3
  Top 0.61: 19.76,82.05 19.73,82.02 19.2,82.02 18.46,81.29 R51.2 16.44,81.4 14.19,81.4 R59.2 14,81.27 IPS2.1
IPS2_SH  (via drill 0.6)
  Top 0.61: U$1.1 54.03,78.34 R6.2 58.34,80.84 v58.5,81 | v64.5,104 68.5,104 68.5,104.08 R72.1
  Bottom 0.61: v58.5,81 58.5,86.5 59,87 63,87 64,88 64,103.5 v64.5,104
IPS3_AD  (via drill 0.6)
  Top 0.61: R14.2 43.55,84 37.5,84 v37,84.5 | v37,96 36.5,96.5 27.5,96.5 26.7,97.3 26.65,97.3 26.61,97.34 U$30.6
  Bottom 0.61: v37,84.5 37,91.5 | 37,91.5 v37,96 | IPS_AD.1 36.16,90.66 37,91.5
IPS3_FILTER
  Top 0.406: 59.01,93.5 U$4.10
  Top 0.61: R2.2 C78.1 67.93,92.5 66.93,93.5 59.01,93.5
IPS3_N
  Top 0.254: 19.88,98.61 U$30.2
  Top 0.61: 19.88,98.61 19.17,98.61 18.13,99.65 R58.1 R50.1 13.99,99.62 IPS3.5 IPS3.4 IPS3.3 IPS3.2
IPS3_OUT  (via drill 0.6)
  Top 0.406: U$4.8 U$4.9
  Top 0.61: U$4.8 58.99,89.44 59.93,88.5 66,88.5 66.5,88 66.5,87.98 C77.1 67.5,86.02 67.5,84.5 68,84 v68.5,84
  Bottom 0.61: IPS_OUT.3 79.7,84.7 79,84 v68.5,84
IPS3_P
  Top 0.254: U$30.3 19.66,97.34 19.44,97.12
  Top 0.61: 19.02,96.7 19.12,96.81 | 19.12,96.81 19.44,97.12 19.6,97.29 | 19.12,96.81 R58.2 16.95,96.7 13.91,96.7 R50.2 13.75,97.07 IPS3.1
IPS3_SH
  Top 0.61: U$1.14 59.5,78.8 59.5,80 60,80.5 63,80.5 63.16,80.67 R12.1 63.16,81.17 64.5,82.5 74.5,82.5 75,83 75,89.35 R1.1
N$2
  Top 0.61: LP3992.4 47.13,59.2 47.93,60 54.83,60 U$5.P
N$3
  Top 0.61: R4.2 46.04,80.84 R6.1 52.13,77.37 52.5,77 54.1,77 U$1.2
N$4
  Top 0.61: R5.2 R7.2 46.58,74.85 47.43,75.7 U$1.3
N$5
  Top 0.61: R16.2 45.8,20.94 45.8,22.37 46.43,23 48.46,23 R18.1 48.49,19.99 49.28,19.2 52.24,19.2 U$2.2
N$6
  Top 0.61: R10.2 R11.1 48.77,67.37 48.77,69.6 51.06,71.88 U$1.6
N$7
  Top 0.254: 53.09,73.15 U$1.5
  Top 0.61: 53.09,73.15 52.84,72.9 50.05,72.9 49.15,72 R8.2 R9.2
N$8
  Top 0.254: 51.93,18 52.25,18 U$2.3
  Top 0.61: R19.2 R17.2 45.93,16.5 46.93,17.5 51.43,17.5 51.93,18
N$9
  Top 0.61: R1.2 69.89,89.49 R2.1 C77.2
N$10
  Top 0.61: 67.53,32.55 R53.1 C81.2 R3.2
N$11  (via drill 0.6)
  Top 0.61: C83.2 R69.1 44,97.5 44,102 45,103 51,103 v52,102 | v52,85.5 52.05,84.95 R68.2
  Bottom 0.61: v52,102 v52,85.5
N$12
  Top 0.61: LED3.A R27.1
N$14
  Top 0.61: R28.1 LED1.A
N$15
  Top 0.61: 69.68,98.45 R73.1 C87.2 69.95,101.57 R72.2
N$16
  Top 0.254: 51.5,15.5 52.25,15.5 U$2.5
  Top 0.61: R23.2 R20.2 48.5,11 49,11.5 49,14 50.5,15.5 51.5,15.5
N$17
  Top 0.61: C89.2 R75.1 R74.2
N$19
  Top 0.406: R79.1 C93.2 R78.2
N$20
  Top 0.61: 68.08,78.03 R13.1 68.08,77.9 68.08,79.85 67.13,80.8 R12.2 65,80.73 65,78.5 64,77.5 62.5,77.5 61.96,76.96 U$1.13
N$21  (via drill 0.6)
  Top 0.61: R15.1 R14.1 45.95,85.95 46,86 49.5,86 50.5,87 56.5,87 57.5,86 63,86 v63.5,85.5 | v63.5,75.85 63.45,75.85 63.1,75.5 59.13,75.5 U$1.12
  Bottom 0.61: v63.5,85.5 v63.5,75.85
N$22
  Top 0.61: U$2.6 50.57,14.14 49.93,13.5 49.93,7.53 R25.1 50,7.46 50,5.5 49.5,5 R24.2
N$23
  Top 0.254: U$2.13 57.63,19.22 57.63,19.25
  Top 0.61: 57.66,19.28 57.63,19.25 57.88,19.2 63.5,19.2 64.5,18 R29.1 65.45,18.1 R26.2
N$24  (via drill 0.6)
  Top 0.61: R31.1 45.95,26 | 45.95,26 R30.1 | U$2.12 v58.95,17.95 | v59,26 45.95,26
  Bottom 0.61: v58.95,17.95 59.5,18.5 59.5,25.5 v59,26
VPS1_AD
  Top 0.61: R20.1 32,11 | 32,11 29,11 27,13 24.38,13 U$28.6 | VPS_AD.1 33.19,12.19 32,11
VPS1_FILTER
  Top 0.61: C94.1 45.88,36.24 R79.2 52.03,35.5 U$6.5
VPS1_N
  Top 0.254: 18.63,14.36 19.36,14.36 U$28.2
  Top 0.61: VPS1.2 VPS1.3 VPS1.4 VPS1.5 9.03,15.3 R49.1 R57.1 16.95,15.35 17.94,14.36 18.63,14.36
VPS1_OUT  (via drill 0.6)
  Top 0.254: 52.19,32.83 51.5,32.83 51.5,33
  Top 0.61: U$6.7 52.17,32.82 52.19,32.83 U$6.6 | C93.1 49.5,33 | 49.5,33 51.5,33 | v62.95,8.8 v55.7,8.8 | v48.5,31.65 48.5,32 49.5,33
  Bottom 0.61: 63.47,8.82 v62.95,8.8 63.15,9 78,9 79.51,10.51 VPS_OUT.3 | v55.7,8.8 48.2,8.8 47.5,9.5 47.5,30.5 v48.5,31.65
VPS1_P
  Top 0.254: 18.5,13 19.38,13 U$28.3
  Top 0.61: VPS1.1 9.88,13.12 10.5,12.5 R57.2 | R49.2 R57.2 | R57.2 17.5,12.5 18,13 18.5,13
VPS1_SH  (via drill 0.6)
  Top 0.61: R25.2 51.85,10 | 51.85,10 51.85,12.46 U$2.7 | R78.1 52.5,30.5 v53.3,30 | v53.3,11.2 52.85,11 51.85,10
  Bottom 0.61: v53.3,30 v53.3,11.2
VPS2_AD
  Top 0.61: U$29.6 25.85,29.25 26.5,28.6 26.5,24.5 27,24 35.5,24 36,23.5 36,18.5 | 36,18.5 36,18 37,17 R17.1 | VPS_AD.2 35.09,17.59 36,18.5
VPS2_FILTER
  Top 0.61: 60.04,38.03 C90.1 R75.2 | 60.04,38.03 59.87,37.89 57.75,37.89 | U$6.12 60.04,37.89 60.04,38.03
VPS2_N
  Top 0.254: 18.8,30.53 U$29.2
  Top 0.61: VPS2.2 VPS2.3 VPS2.4 VPS2.5 R22.1 R56.1 17.66,30.55 18.8,30.53
VPS2_OUT  (via drill 0.6)
  Top 0.61: U$6.14 U$6.13 | C89.1 57.3,44.8 57,44.5 57,40.41 | v59,40 57.41,40 U$6.14 | 57,40 57,40.41 | 57,40.41 U$6.14
  Bottom 0.61: VPS_OUT.2 81.36,13.36 82.5,14.5 82.5,25 81.5,26 77.5,26 77,26.5 77,39 76,40 v59,40
VPS2_P
  Top 0.254: 18.45,29.25 U$29.3 | R22.2 14.1,28.73 14.1,28.95
  Top 0.61: VPS2.1 14.1,28.95 14.25,28.95 14.45,28.75 | R22.2 R56.2 17.93,28.73 18.45,29.25
VPS2_SH  (via drill 0.6)
  Top 0.61: R18.2 51.53,22.97 52,22.5 | 52,22.5 52,20.74 U$2.1 | 52,22.5 v52,24.5 | v66.5,43.5 67.5,42.5 67.5,41.92 R74.1
  Bottom 0.61: v52,24.5 52,42.5 53,43.5 v66.5,43.5
VPS3_AD  (via drill 0.6)
  Top 0.61: R30.2 31.5,25.5 v31,26 | U$31.6 24.4,44.5 30.5,44.5 v31,44
  Bottom 0.61: v31,44 v31,26 31,21 31.87,20.13 VPS_AD.3
VPS3_FILTER
  Top 0.254: U$6.10 57.43,35.35 57.43,35.3
  Top 0.61: 65.43,35.3 65.43,35.8 C82.1 65.48,35.35 65.43,35.3 | 65.43,35.3 65.43,32.85 R53.2 | 65.43,35.3 57.43,35.3
VPS3_N
  Top 0.61: U$31.2 18.22,45.71 17.71,46.73 17.46,47.16 R55.1 R21.1 VPS3.5 VPS3.4 VPS3.3 VPS3.2
VPS3_OUT  (via drill 0.6)
  Top 0.61: U$6.9 U$6.8 56.93,32.75 56.93,30.3 57.43,29.8 C81.1 65.5,29.78 v65.5,27.75
  Bottom 0.61: VPS_OUT.1 79.51,18.99 79,19.5 71.5,19.5 71,20 71,24.5 70,25.5 66.5,25.5 65.5,26.5 v65.5,27.75
VPS3_P
  Top 0.254: 18.6,44.45 U$31.3
  Top 0.61: VPS3.1 13.65,44.8 R21.2 R55.2 18.11,44.54 18.2,44.45 18.6,44.45
VPS3_SH  (via drill 0.6)
  Top 0.61: 57.07,20.5 U$2.14 57.57,21 R26.1 63.5,20.55 v63.5,22.75 | R3.1 71.88,31.62 v71.5,32
  Bottom 0.61: v71.5,32 64.5,32 63.5,31 v63.5,22.75

### Text on the board
tPlace: Adapter Board V1 / 11.02.2020 / zya-tch